# EAGLE schematic Commutator_Adaptor (EAGLE 9.0.0)
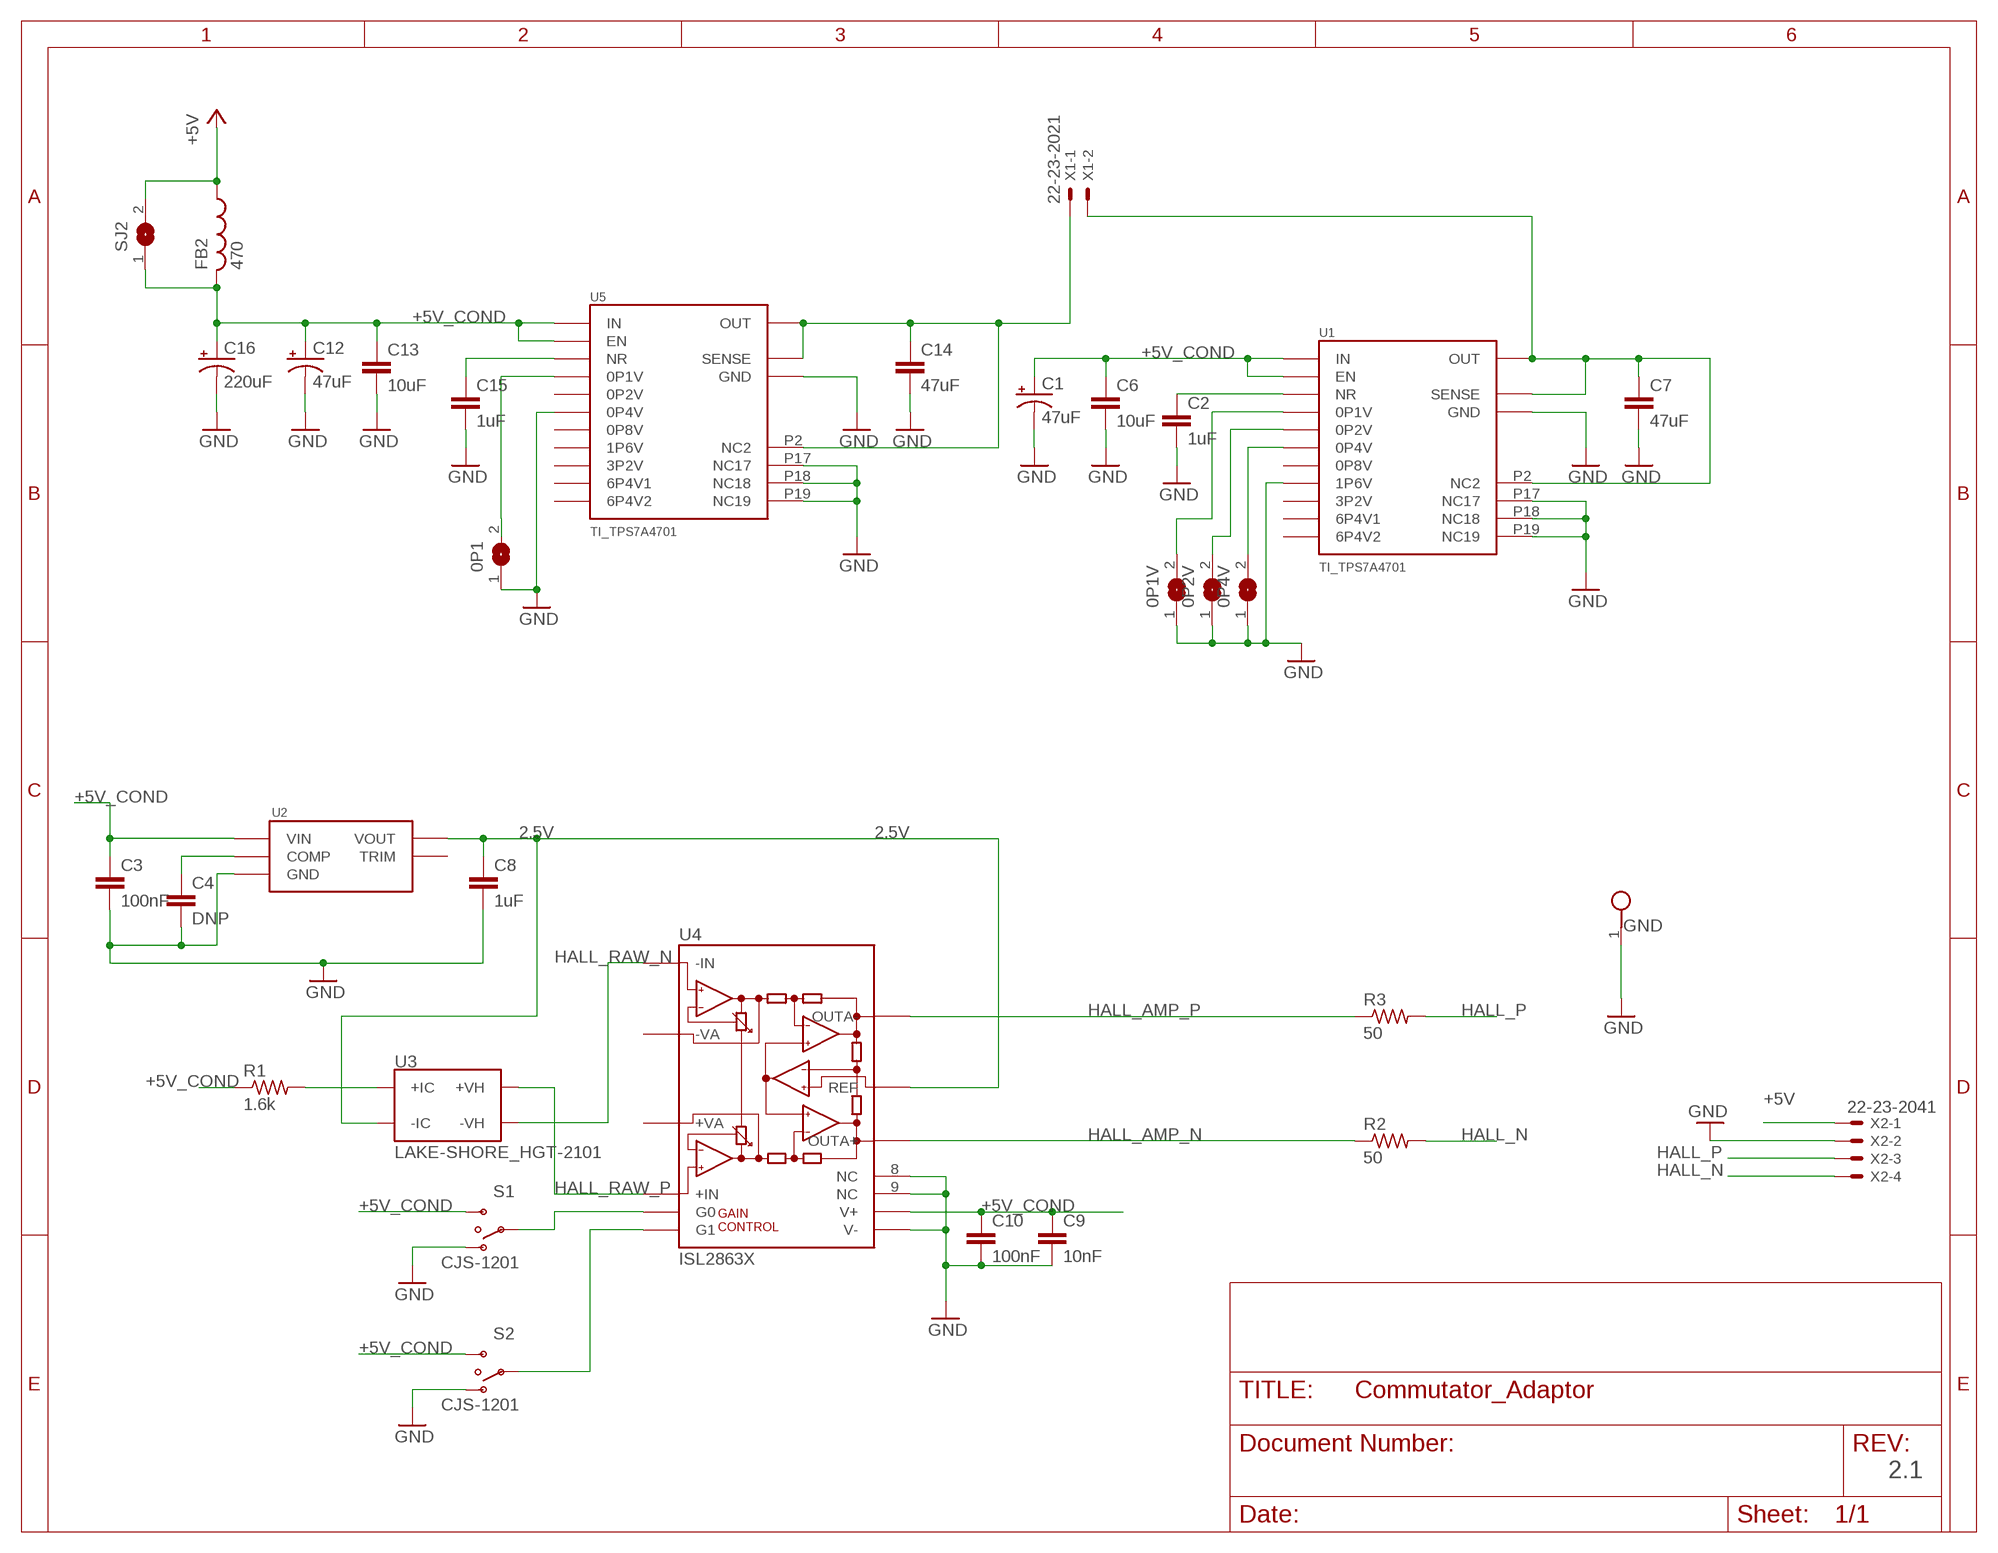
[diagram p0: schematic, sheet 1]

## Parts
0P1  SJ  [SJ]
0P1V  SJ  [SJ]
0P2V  SJ  [SJ]
0P4V  SJ  [SJ]
C1  47uF  CPOL1210  [1210POL]
C2  1uF  C_0603  [0603]
C3  100nF  C_0402  [0402]
C4  DNP  C_0402  [0402]
C6  10uF  C_0805  [0805]
C7  47uF  C_1210  [1210]
C8  1uF  C_0603  [0603]
C9  10nF  C_0402  [0402]
C10  100nF  C_0402  [0402]
C12  47uF  CPOL1210  [1210POL]
C13  10uF  C_0805  [0805]
C14  47uF  C_1210  [1210]
C15  1uF  C_0603  [0603]
C16  220uF  CPOL_JA0  [JA0]
FB2  470  L_0603  [0603]
GND  TESTPOINT_SMALL  [TESTPOINT_SMALL]
R1  1.6k  R_0402  [0402]
R2  50  R_0402  [0402]
R3  50  R_0402  [0402]
S1  CJS-1201  [CJS-1201A1]
S2  CJS-1201  [CJS-1201A1]
SJ2  SJ  [SJ]
U1  TI_TPS7A4701  [20-VQFN(5X5)]
U2  ISL21090  [SO08]
U3  LAKE-SHORE_HGT-2101  [HGT-2101-SIDE]
U4  ISL2863X  [TSSOP14]
U5  TI_TPS7A4701  [20-VQFN(5X5)]
X1  22-23-2021  [22-23-2021]
X2  22-23-2041  [22-23-2041]

## Nets
1P8: C14.POS U5.P1(OUT) U5.P2(NC2) U5.P3(SENSE) U5.P20(OUT) X1.1
2.5V: C8.1 U2.6(VOUT) U3.PIN1(-IC) U4.11(REF)
3P3: C7.POS U1.P1(OUT) U1.P2(NC2) U1.P3(SENSE) U1.P20(OUT) X1.2
+5V: FB2.1 SJ2.2 X2.1
+5V_COND: C1.POS(+) C3.1 C6.1 C9.1 C10.1 C12.POS(+) C13.1 C16.POS(+) FB2.2 R1.1 S1.P$3(S) S2.P$3(S) SJ2.1 U1.P13(EN) U1.P15(IN) U1.P16(IN) U2.2(VIN) U4.14(V+) U5.P13(EN) U5.P15(IN) U5.P16(IN)
GND: 0P1.1 0P1V.1 0P2V.1 0P4V.1 C1.NEG(-) C2.2 C3.2 C4.2 C6.2 C7.NEG C8.2 C9.2 C10.2 C12.NEG(-) C13.2 C14.NEG C15.2 C16.NEG(-) GND.1 S1.P$1(O) S2.P$1(O) U1.P7(GND) U1.P8(1P6V) U1.P17(NC17) U1.P18(NC18) U1.P19(NC19) U1.THERMAL@1(GND) U1.THERMAL@2(GND) U1.THERMAL@3(GND) U1.THERMAL@4(GND) U1.THERMAL@5(GND) U1.THERMAL@6(GND) U1.THERMAL@7(GND) U1.THERMAL@8(GND) U1.THERMAL@9(GND) U1.THERMAL@10(GND) U2.4(GND) U4.7(V-) U4.8(NC) U4.9(NC) U5.P7(GND) U5.P10(0P4V) U5.P17(NC17) U5.P18(NC18) U5.P19(NC19) U5.THERMAL@1(GND) U5.THERMAL@2(GND) U5.THERMAL@3(GND) U5.THERMAL@4(GND) U5.THERMAL@5(GND) U5.THERMAL@6(GND) U5.THERMAL@7(GND) U5.THERMAL@8(GND) U5.THERMAL@9(GND) U5.THERMAL@10(GND) X2.2
HALL_AMP_N: R2.1 U4.12(OUTA+)
HALL_AMP_P: R3.1 U4.10(OUTA-)
HALL_N: R2.2 X2.4
HALL_P: R3.2 X2.3
HALL_RAW_N: U3.WIRE1(-VH) U4.5(-IN)
HALL_RAW_P: U3.PIN2(+VH) U4.4(+IN)
I_HALL: R1.2 U3.WIRE2(+IC)
N$1: C4.1 U2.3(COMP)
N$2: S1.P$2(P) U4.1(G0)
N$3: C15.1 U5.P14(NR)
N$4: S2.P$2(P) U4.2(G1)
N$5: 0P4V.2 U1.P10(0P4V)
N$6: C2.1 U1.P14(NR)
N$7: 0P2V.2 U1.P11(0P2V)
N$8: 0P1.2 U5.P12(0P1V)
N$9: 0P1V.2 U1.P12(0P1V)
Unconnected: U1.P4(6P4V2) U1.P5(6P4V1) U1.P6(3P2V) U1.P9(0P8V) U2.5(TRIM) U4.3(-VA) U4.6(+VA) U5.P4(6P4V2) U5.P5(6P4V1) U5.P6(3P2V) U5.P8(1P6V) U5.P9(0P8V) U5.P11(0P2V)

## Notes on the sheet
- 2.1

## Library data of the parts
0P1 0P1V 0P2V 0P4V SJ2 = jumper:SJ: SMD solder JUMPER
C1 C12 C16 = GFL:CPOL
C2-C4 C6-C10 C13-C15 = GFL:C: Capacitor
FB2 = GFL:L
GND = RHD2000_eval_board:TESTPOINT: PCB Test Point
R1-R3 = GFL:R: Resistor
S1 S2 = GFL:CJS-1201
U1 U5 = GFL:TI_TPS7A4701: TPS7A4701RGWR - 36-V, 1-A, 4-μV RMS, RF LDO Voltage Regulator Technical Specifications: Input voltage range: +3 to +36V Output Voltage Noise: 4 μV RMS (10 Hz, 100 kHz) Digikey: 296-37224-1-ND Mouser: 595-TPS7A4701RGWR
U2 = GFL:ISL21090
U3 = GFL:LAKE-SHORE_HGT-2101
U4 = GFL:ISL2863X
X1 = con-molex:22-23-2021: .100" (2.54mm) Center Header - 2 Pin; MF: MOLEX; MPN: 22-23-2021; OC_FARNELL: 1462926; OC_NEWARK: 25C3832
X2 = con-molex:22-23-2041: .100" (2.54mm) Center Header - 4 Pin; MF: MOLEX; MPN: 22-23-2041; OC_FARNELL: 1462920; OC_NEWARK: 38C0355